# Altium project AEGIS_Junction_Box.PrjPcb
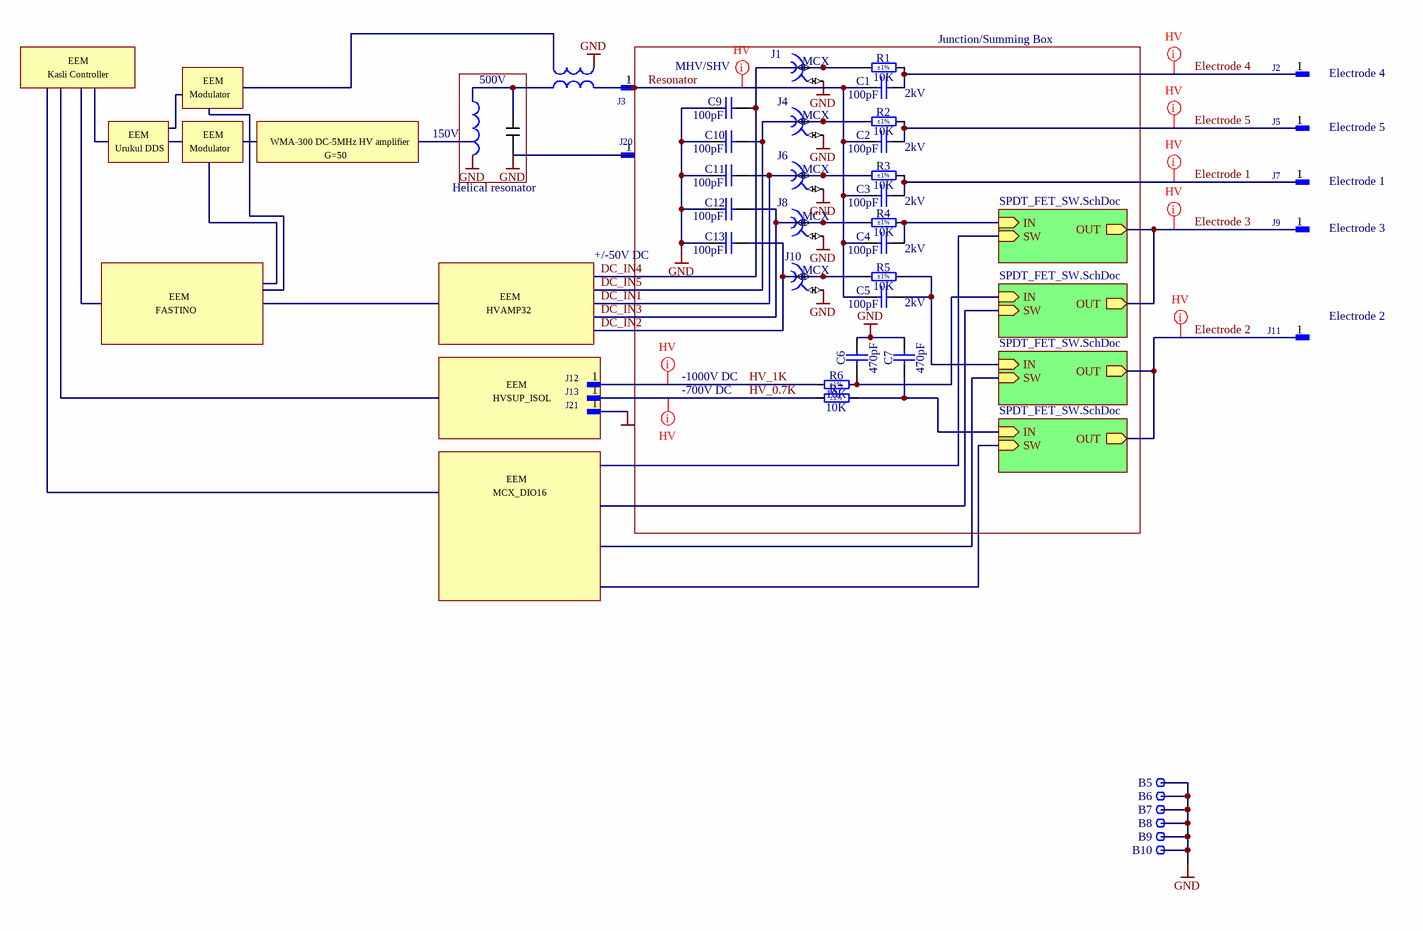
[diagram p0: AEGIS_Junction_Box.SchDoc]
2 sheets, 144 parts. Net scope: hierarchical (ports join the sheet entries above them; power ports are global).
Board file: AEGIS_Junction_Box.PcbDoc
Sheets:
  AEGIS_Junction_Box.SchDoc
    SPDT_HV_SW0 = SPDT_FET_SW.SchDoc
    SPDT_HV_SW1 = SPDT_FET_SW.SchDoc
    SPDT_HV_SW2 = SPDT_FET_SW.SchDoc
    SPDT_HV_SW3 = SPDT_FET_SW.SchDoc

## Sheet AEGIS_Junction_Box.SchDoc: AEGIS
size 420 x 297 mm; Author: G.Kasprowicz; CompanyName: WUT ISE; DrawnBy: G.Kasprowicz; Organization: WUT ISE; Address1: PW ISE; Address2: Nowowiejska 15/19 00-665 Warsaw; Address3: gkasprow@gmail.com; Revision: 2; SheetNumber: -; SheetTotal: -; ModifiedBy: -; CheckedDate: -; Title2: Junction Box; DivGrp: WUT ISE; Designer: G.Kasprowicz; ModifiedDate: -; ProjectName: Sensor Box

### Parts
B5  Plated Hole  [MTG320_550]  (value not drawn)  (no BOM)
B6  Plated Hole  [MTG320_550]  (value not drawn)  (no BOM)
B7  Plated Hole  [MTG320_550]  (value not drawn)  (no BOM)
B8  Plated Hole  [MTG320_550]  (value not drawn)  (no BOM)
B9  Plated Hole  [MTG320_550]  (value not drawn)  (no BOM)
B10  Plated Hole  [MTG320_550]  (value not drawn)  (no BOM)
C1  100pF  Voltage: 2kV  [CAPC3216X180N]
C2  100pF  Voltage: 2kV  [CAPC3216X180N]
C3  100pF  Voltage: 2kV  [CAPC3216X180N]
C4  100pF  Voltage: 2kV  [CAPC3216X180N]
C5  100pF  Voltage: 2kV  [CAPC3216X180N]
C6  470pF  [CAPC4520X150N]
C7  470pF  [CAPC4520X150N]
C9  100pF  [CAPC2012X135N]
C10  100pF  [CAPC2012X135N]
C11  100pF  [CAPC2012X135N]
C12  100pF  [CAPC2012X135N]
C13  100pF  [CAPC2012X135N]
J1  MCX  [AMPHENOL_919-383J-51A]
J2  SMD Pad  [R400X300]  (value not drawn)
J3  SMD Pad  [R400X300]  (value not drawn)
J4  MCX  [AMPHENOL_919-383J-51A]
J5  SMD Pad  [R400X300]  (value not drawn)
J6  MCX  [AMPHENOL_919-383J-51A]
J7  SMD Pad  [R400X300]  (value not drawn)
J8  MCX  [AMPHENOL_919-383J-51A]
J9  SMD Pad  [R400X300]  (value not drawn)
J10  MCX  [AMPHENOL_919-383J-51A]
J11  SMD Pad  [R400X300]  (value not drawn)
J12  SMD Pad  [R400X300]  (value not drawn)
J13  SMD Pad  [R400X300]  (value not drawn)
J20  SMD Pad  [R400X300]  (value not drawn)
J21  SMD Pad  [R400X300]  (value not drawn)
R1  10K  Tolerance: ±1%  [RESC6532X80N]
R2  10K  Tolerance: ±1%  [RESC6532X80N]
R3  10K  Tolerance: ±1%  [RESC6532X80N]
R4  10K  Tolerance: ±1%  [RESC6532X80N]
R5  10K  Tolerance: ±1%  [RESC6532X80N]
R6  10K  Tolerance: ±1%  [RESC6532X80N]
R7  10K  Tolerance: ±1%  [RESC6532X80N]

### Sub-sheets
SPDT_HV_SW0 = SPDT_FET_SW.SchDoc: IN (in), OUT (out), SW (in)
SPDT_HV_SW1 = SPDT_FET_SW.SchDoc: IN (in), OUT (out), SW (in)
SPDT_HV_SW2 = SPDT_FET_SW.SchDoc: IN (in), OUT (out), SW (in)
SPDT_HV_SW3 = SPDT_FET_SW.SchDoc: IN (in), OUT (out), SW (in)

### Nets
GND: B5.1 B6.1 B7.1 B8.1 B9.1 B10.1 C6.2 C7.2 C9.1 C10.1 C11.1 C12.1 C13.1 J1.2 J4.2 J6.2 J8.2 J10.2 J20.1 J21.1
DC_IN1: C11.2 J6.1 R3.1
DC_IN2: C13.2 J10.1 R5.1
DC_IN3: C12.2 J8.1 R4.1
DC_IN4: C9.2 J1.1 R1.1
DC_IN5: C10.2 J4.1 R2.1
Electrode 1: C3.2 J7.1 R3.2
Electrode 2: J11.1 ; sheet SPDT_HV_SW2/OUT, sheet SPDT_HV_SW3/OUT
Electrode 3: J9.1 ; sheet SPDT_HV_SW0/OUT, sheet SPDT_HV_SW1/OUT
Electrode 4: C1.2 J2.1 R1.2
Electrode 5: C2.2 J5.1 R2.2
HV_0.7K: J13.1 R7.1
HV_1K: J12.1 R6.1
Resonator: C1.1 C2.1 C3.1 C4.1 C5.1 J3.1
NetC4_2: C4.2 R4.2 ; sheet SPDT_HV_SW0/IN
NetC5_2: C5.2 R5.2 ; sheet SPDT_HV_SW2/IN
NetC6_1: C6.1 R6.2 ; sheet SPDT_HV_SW1/IN
NetC7_1: C7.1 R7.2 ; sheet SPDT_HV_SW3/IN

### Layout directives
net class HV: Electrode 1, Electrode 2, Electrode 3, Electrode 4, Electrode 5, HV_0.7K, HV_1K, Resonator

### Notes on the sheet
- Kasli Controller
- EEM
- Modulator
- 500V
- MHV/SHV
- Junction/Summing Box
- (near J2) Electrode 4
- Urukul DDS
- WMA-300 DC-5MHz HV amplifier
- G=50
- 150V
- (near J5) Electrode 5
- Helical resonator
- (near J7) Electrode 1
- (near J9) Electrode 3
- +/-50V DC
- FASTINO
- HVAMP32
- -1000V DC
- (near J11) Electrode 2
- HVSUP_ISOL
- -700V DC
- MCX_DIO16
- Labels drawn without touching a wire or pin: GND
- Project/Equipment
- Document
- Designer
- Drawn by
- Check.by
- Copyright WUT ISE 2020.
  This documentation describes Open Hardware and is licensed under the CERN OHL v.1.2. You may redistribute and modify this documentation under the terms of the CERN OHL v.1.2. (http://ohwr.org/CERNOHL). This documentation is distributed WITHOUT ANY EXPRESS OR IMPLIED WARRANTY, INCLUDING OF MERCHANTABILITY, SATISFACTORY QUALITY AND FITNESS FOR A PARTICULAR PURPOSE. Please see the CERN OHL v.1.2 for applicable conditions.
- Contact
- File
- Last Mod.
- Print Date
- Sheet
- Size
- A3
- of
- Rev

### Library data of the parts
B5-B10 = PLATED_HOLE3.2_PAD5.5: Single Terminal Socket; Part Description: Plated Through Hole: Hole Dia.=3.2mm Pad Dia.=5.5mm; Mounted: No; Part Number: PLATED_HOLE3.2_PAD5.5; Component Type: Standard (No BOM); Pin Count: 1; Family: Plated Hole; Socket: No; SMD: No; Sense: No; Status: None; ComponentHeight: 0mm; HelpURL: Undefined; Author: CERN DEM JMW; CreateDate: 01.10.2012; LatestRevisionDate: 01.10.2012; PackageDescription: Plated Through Hole: Hole Dia.=3.2mm Pad Dia.=5.5mm
C1-C5 = CC1206_100PF_2KV_5%_C0G: Non-polarised capacitor; Part Description: High Voltage MLC Chip Capacitor; Manufacturer: GENERIC; Manufacturer1 Part Number: 1206GA101JAT2A; TC: C0G/NP0; Tolerance: ±5%; Part Number: CC1206_100PF_2KV_5%_C0G; Component Kind: Standard; Component Type: Standard; Pin Count: 2; Value: 100pF; Status: None; Manufacturer Part Number: CC1206_100PF_2KV_5%_C0G; Case: 1206; Mounted: Yes; Socket: No; SMD: Yes; Sense: No; Manufacturer1 Example: AVX; Manufacturer1 ComponentHeight: 1.8mm; HelpURL: \\cern.ch\dfs\Applications\Altium\Datasheets\CC1206_C0G_AVX_HV-MLC.pdf; Author: CERN DEM JLC; CreateDate: 17.05.2017; LatestRevisionDate: 17.05.2017
C6 C7 = CC1808_470PF_2KV_20%_X7R_TDK_CGA7K1X7R3D471M130KA: Non-polarised capacitor; Part Description: High Voltage SMD Multilayer Chip Ceramic Capacitor (Automotive Grade); Manufacturer: TDK; Voltage: 2kV; TC: X7R; Tolerance: ±20%; Part Number: CC1808_470PF_2KV_20%_X7R_TDK_CGA7K1X7R3D471M130KA; Component Kind: Standard; Component Type: Standard; Pin Count: 2; Value: 470pF; Status: Not Recommended; Manufacturer Part Number: CGA7K1X7R3D471M130KA; Case: 1808; Mounted: Yes; Socket: No; SMD: Yes; Sense: No; ComponentHeight: 1.5mm; HelpURL: \\cern.ch\dfs\Applications\Altium\Datasheets\CC1808_X7R_TDK_CGA-HV.pdf; Author: CERN DEM JLC; CreateDate: 30.11.2016; LatestRevisionDate: 30.11.2016
C9-C13 = CC0805_100PF_50V_5%_NP0: Non-polarised capacitor; Part Description: SMD Multilayer Chip Ceramic Capacitor; Manufacturer: GENERIC; Manufacturer1 Part Number: 223886115101; Voltage: 50V; TC: C0G/NP0; Tolerance: ±5%; Part Number: CC0805_100PF_50V_5%_NP0; Component Kind: Standard; Component Type: Standard; Pin Count: 2; Value: 100pF; Status: Preferred; Manufacturer Part Number: CC0805_100PF_50V_5%_NP0; Case: 0805; Mounted: Yes; Socket: No; SMD: Yes; Sense: No; Manufacturer1 Example: PHYCOMP; Manufacturer1 ComponentHeight: 1.35mm; HelpURL: \\cern.ch\dfs\Applications\Altium\Datasheets\CC0805_NP0_PHYCOMP.pdf; Author: CERN DEM JLC; CreateDate: 03.12.2007; LatestRevisionDate: 03.12.2007
J1 J4 J6 J8 J10 = AMPHENOL_919-383J-51A: Part Description: 50 Ohm, RF Connector, MCX Right Angle PCB Receptacle Jack; PressFit: No; Part Number: AMPHENOL_919-383J-51A; Component Kind: Standard; Component Type: Standard; Pin Count: 5; Family: MCX; Mounted: Yes; Socket: No; SMD: No; Sense: No; Status: None; Manufacturer: AMPHENOL; Manufacturer Part Number: 919-383J-51A; ComponentHeight: 6mm; HelpURL: \\cern.ch\dfs\Applications\Altium\Datasheets\AMPHENOL_919-383J-51A.pdf; Author: CERN DEM BC; CreateDate: 31.01.2019; LatestRevisionDate: 31.01.2019
J2 J3 J5 J7 J9 J11-J13 J20 J21 = SMD_PAD_4X3MM: Single SMD Pad; Part Description: 4mm x 3mm SMD Pad; Mounted: No; Part Number: SMD_PAD_4X3MM; Component Kind: Standard (No BOM); Component Type: Standard (No BOM); Pin Count: 1; Family: SMD Pad; Socket: No; SMD: No; Sense: No; Status: None; ComponentHeight: 0mm; HelpURL: Undefined; Author: CERN DEM JLC; CreateDate: 15.03.2010; LatestRevisionDate: 15.03.2010; PackageDescription: 4mm x  3mm SMD Pad
R1-R7 = R2512_10k_1%_1W_100PPM: High Voltage (3kV) Chip Resistor; Manufacturer: TT Electronics; Manufacturer Part Number: HVC2512-10KFT18; Power: 1W; TC: ±100ppm/°C; PressFit: No; Part Number: R2512_10k_1%_1W_100PPM; Component Kind: Standard; Component Type: Standard; Pin Count: 2; Value: 10K; Status: None; Part Description: High Voltage (3kV) Chip Resistor; Case: 2512; Mounted: Yes; Sense: No; Socket: No; SMD: Yes; ComponentHeight: 0.8mm; HelpURL: \\cern.ch\dfs\Applications\Altium\Datasheets\R2512_TT ELECTRONICS_HVC.pdf; Author: GK; CreateDate: 26.11.2014; LatestRevisionDate: 26.11.2014

## Sheet SPDT_FET_SW.SchDoc: AEGIS
size 420 x 297 mm; Author: G.Kasprowicz; CompanyName: WUT ISE; DrawnBy: G.Kasprowicz; Organization: WUT ISE; Address1: PW ISE; Address2: Nowowiejska 15/19 00-665 Warsaw; Address3: gkasprow@gmail.com; Revision: 2; SheetNumber: -; SheetTotal: -; ModifiedBy: -; CheckedDate: -; Title2: SPDT HV FET SWITCH; DivGrp: WUT ISE; Designer: G.Kasprowicz; ModifiedDate: -; ProjectName: Sensor Box
Used 4 times, as channels SPDT_HV_SW0, SPDT_HV_SW1, SPDT_HV_SW2, SPDT_HV_SW3. Parts and nets are listed once, with the designators drawn on the sheet.
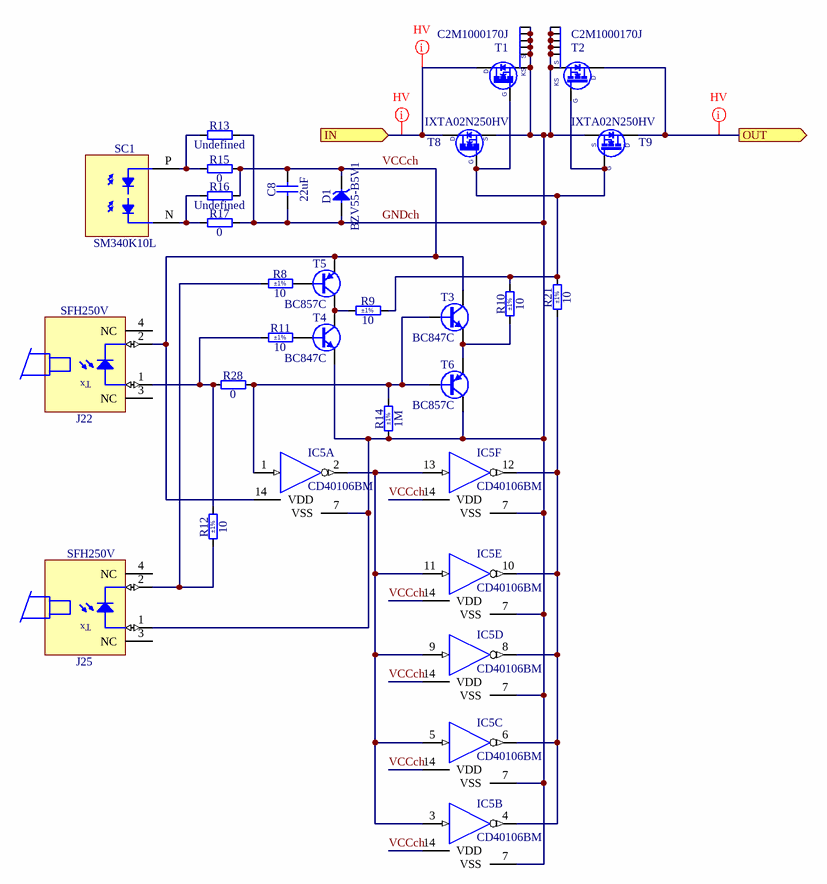
[diagram p1: SPDT_FET_SW.SchDoc]

### Parts
C8  22uF  [CAPC2012X145N]
D1  BZV55-B5V1  [DIOMELF3515N]
IC5  CD40106BM  [SOIC127P600X175-14N]  (parts A,B,C,D,E,F of 6)
J22  SFH250V  [SFH250V]
J25  SFH250V  [SFH250V]
R8  10  Tolerance: ±1%  [RESC1608X55N]
R9  10  Tolerance: ±1%  [RESC1608X55N]
R10  10  Tolerance: ±1%  [RESC1608X55N]
R11  10  Tolerance: ±1%  [RESC1608X55N]
R12  10  Tolerance: ±1%  [RESC1608X55N]
R13  Undefined  [RESC1608X55N]
R14  1M  Tolerance: ±1%  [RESC1005X40N]
R15  0  [RESC1608X55N]
R16  Undefined  [RESC1608X55N]
R17  0  [RESC1608X55N]
R21  10  Tolerance: ±1%  [RESC1608X55N]
R28  0  [RESC1608X55N]
SC1  SM340K10L  [SM340K10L]
T1  C2M1000170J  [WOLFSPEED_TO-263-7]
T2  C2M1000170J  [WOLFSPEED_TO-263-7]
T3  BC847C  [SOT95P240X110-3N]
T4  BC847C  [SOT95P240X110-3N]
T5  BC857C  [SOT95P240X110-3N]
T6  BC857C  [SOT95P240X110-3N]
T8  IXTA02N250HV  [IXYS_TO-263AB]
T9  IXTA02N250HV  [IXYS_TO-263AB]

### Ports
IN (in), OUT (out)

### Nets
GNDch: C8.1 D1.2(A) IC5.7(VSS) J25.1(A) R13.2 R14.1 R17.2 T1.2(S) T1.3(S) T1.4(S) T1.5(S) T1.6(S) T1.7(S) T2.2(S) T2.3(S) T2.4(S) T2.5(S) T2.6(S) T2.7(S) T4.2(E) T6.3(C) T8.2(S) T9.2(S)
IN: T1.8(D) T8.3(D) ; port IN
OUT: T2.8(D) T9.3(D) ; port OUT
VCCch: C8.2 D1.1(C) IC5.14(VDD) J22.2(C) R15.2 R16.2 T3.3(C) T5.2(E)
NetIC5_1: IC5.1(IN) R14.2 R28.2 T3.1(B) T6.1(B)
NetIC5_2: IC5.2(OUT) IC5.3(IN) IC5.5(IN) IC5.9(IN) IC5.11(IN) IC5.13(IN)
NetIC5_4: IC5.4(OUT) IC5.6(OUT) IC5.8(OUT) IC5.10(OUT) IC5.12(OUT) R21.1
NetJ22_1: J22.1(A) R11.1 R12.2 R28.1
NetJ25_2: J25.2(C) R8.1 R12.1
NetR8_2: R8.2 T5.1(B)
NetR9_1: R9.1 T4.3(C) T5.3(C)
NetR9_2: R9.2 R10.2 R21.2 T1.1(G) T2.1(G) T8.1(G) T9.1(G)
NetR10_1: R10.1 T3.2(E) T6.2(E)
NetR11_2: R11.2 T4.1(B)
NetR13_1: R13.1 R15.1 SC1.P
NetR16_1: R16.1 R17.1 SC1.N

Not connected (* = marked no-connect by the designer): J22 3(NC) 4(NC); J25 3(NC) 4(NC)

### Channels
SPDT_HV_SW0: designators end in A; ports IN=NetC4_2 OUT=Electrode 3
SPDT_HV_SW1: designators end in B; ports IN=NetC6_1 OUT=Electrode 3
SPDT_HV_SW2: designators end in C; ports IN=NetC5_2 OUT=Electrode 2
SPDT_HV_SW3: designators end in D; ports IN=NetC7_1 OUT=Electrode 2

### Layout directives
net class HV: Electrode 3, NetC4_2

### Notes on the sheet
- Project/Equipment
- Document
- Designer
- Drawn by
- Check.by
- Copyright WUT ISE 2020.
  This documentation describes Open Hardware and is licensed under the CERN OHL v.1.2. You may redistribute and modify this documentation under the terms of the CERN OHL v.1.2. (http://ohwr.org/CERNOHL). This documentation is distributed WITHOUT ANY EXPRESS OR IMPLIED WARRANTY, INCLUDING OF MERCHANTABILITY, SATISFACTORY QUALITY AND FITNESS FOR A PARTICULAR PURPOSE. Please see the CERN OHL v.1.2 for applicable conditions.
- Contact
- File
- Last Mod.
- Print Date
- Sheet
- Size
- A3
- of
- Rev
- (in symbol C2M1000170J) KS
- (in symbol SFH250V) Tx

### Library data of the parts
C8 = CC0805_22UF_25V_20%_X5R: Non-polarised capacitor; Part Description: Chip Multilayer Ceramic Capacitor for General Purpose; Manufacturer: GENERIC; Manufacturer1 Part Number: GRM21BR61E226ME44; Voltage: 25V; TC: X5R; Tolerance: ±20%; Part Number: CC0805_22UF_25V_20%_X5R; Component Kind: Standard; Component Type: Standard; Pin Count: 2; Value: 22uF; Status: Preferred; Manufacturer Part Number: CC0805_22UF_25V_20%_X5R; Case: 0805; Mounted: Yes; Socket: No; SMD: Yes; Sense: No; ComponentHeight: 1.45mm; Manufacturer1 Example: MURATA; Manufacturer1 ComponentHeight: 1.45mm; HelpURL: \\cern.ch\dfs\Applications\Altium\Datasheets\CC0805_MURATA_GRM21BR61E226ME44.pdf; Author: CERN DEM WB; CreateDate: 08.10.2021; LatestRevisionDate: 08.10.2021
D1 = BZV55-B5V1: Zener Diode; Part Description: Voltage Regulator Diode; Manufacturer: NEXPERIA; Voltage: 5V1; Power: 500mW; PressFit: No; Bonding: No; Part Number: BZV55-B5V1; Component Kind: Standard; Component Type: Standard; Device: BZV55-B5V1; PackageDescription: SOD80C, MELF Diode, 2-Leads, Body 3.5x1.5mm, IPC Medium Density; Manufacturer Part Number: BZV55-B5V1; Pin Count: 2; Case: SOD-80C; Mounted: Yes; Socket: No; SMD: Yes; Sense: No; ComponentHeight: 1.6mm; HelpURL: \\cern.ch\dfs\Applications\Altium\Datasheets\BZV55.pdf; Author: CERN DEM JLC; CreateDate: 06.05.2008; LatestRevisionDate: 22.01.2018
IC5 = CD40106BM: Hex Inverting Schmitt-Trigger; Part Description: CMOS Hex Schmitt Triggers; Manufacturer: TEXAS INSTRUMENTS; PressFit: No; Bonding: No; Part Number: CD40106BM; Component Kind: Standard; Component Type: Standard; Device: CD40106BM; PackageDescription: SOIC 14, Pitch 1.27mm - Body 4x8.75mm, IPC Medium Density; Manufacturer Part Number: CD40106BM; Pin Count: 14; Case: SOIC14; Mounted: Yes; Socket: No; SMD: Yes; Sense: No; ComponentHeight: 1.75mm; Author: CERN DEM JLC; HelpURL: \\cern.ch\dfs\Applications\Altium\Datasheets\CD40106BM.pdf; CreateDate: 17.01.2012; LatestRevisionDate: 17.01.2012
J22 J25 = SFH250V: Plastic Connector Housing For Plastic Fiber Optic Photodiode Detector; Part Description: 100MBd Analog Receiver Diode with Direct Fiber Connector; Manufacturer: AVAGO TECHNOLOGIES; Manufacturer Part Number: SFH250V or SP000063852; PressFit: No; Part Number: SFH250V; Component Kind: Standard; Component Type: Standard; Device: SFH250V; Pin Count: 2; Family: Optical Fiber; Mounted: Yes; Socket: No; SMD: No; Sense: No; Status: None; ComponentHeight: 9mm; HelpURL: \\cern.ch\dfs\Applications\Altium\Datasheets\SFH250V.pdf; Author: CERN DEM JLC; CreateDate: 07.10.2010; LatestRevisionDate: 21.08.2014
R8-R12 R21 = R0603_10R_1%_0.1W_200PPM: Resistor - 1%; Part Description: General Purpose Thick Film Chip Resistor; Manufacturer: GENERIC; Manufacturer1 Part Number: NRC06F10R0TRF; Power: 0.1W; TC: ±200ppm/°C; PressFit: No; Part Number: R0603_10R_1%_0.1W_200PPM; Component Kind: Standard; Component Type: Standard; Pin Count: 2; Value: 10; Status: Preferred; Manufacturer Part Number: R0603_10R_1%_0.1W_200PPM; Case: 0603; Mounted: Yes; Sense: No; Socket: No; SMD: Yes; Manufacturer1 Example: NIC COMPONENT; Manufacturer1 ComponentHeight: 0.55mm; HelpURL: \\cern.ch\dfs\Applications\Altium\Datasheets\R0603_NIC_NRC.pdf; Author: CERN DEM JLC; CreateDate: 03.12.2007; LatestRevisionDate: 24.06.2009
R13 R16 = R0603_NO-VALUE: Resistor; Part Description: Reserved Footprint For a 0603 (1608) Chip Resistor; PressFit: No; Mounted: No; Part Number: R0603_NO-VALUE; Component Kind: Standard; Component Type: Standard; Pin Count: 2; Value: Undefined; Status: None; Manufacturer: Undefined; Manufacturer Part Number: R0603_NO-VALUE; Case: 0603; Sense: No; Socket: No; SMD: Yes; Manufacturer1 Example: Undefined; Manufacturer1 Part Number: Undefined; Manufacturer1 ComponentHeight: Undefined; HelpURL: Undefined; Author: CERN DEM JLC; CreateDate: 03.12.2007; LatestRevisionDate: 13.03.2008
R14 = R0402_1M_1%_0.0625W_100PPM: Resistor - 1%; Part Description: General Purpose Thick Film Chip Resistor; Manufacturer: GENERIC; Manufacturer1 Part Number: 232270671005L; TC: ±100ppm/°C; PressFit: No; Part Number: R0402_1M_1%_0.0625W_100PPM; Component Kind: Standard; Component Type: Standard; Pin Count: 2; Value: 1M; Status: Not Recommended; Power: 0.0625W; Manufacturer Part Number: R0402_1M_1%_0.0625W_100PPM; Case: 0402; Mounted: Yes; Sense: No; Socket: No; SMD: Yes; Manufacturer1 Example: YAGEO PHYCOMP; Manufacturer1 ComponentHeight: 0.4mm; HelpURL: \\cern.ch\dfs\Applications\Altium\Datasheets\R0402_Phycomp_RC0402.pdf; Author: CERN DEM JLC; CreateDate: 03.12.2007; LatestRevisionDate: 17.10.2012
R15 R17 R28 = R0603_0R_JUMPER: Resistor; Part Description: 1A (0.05R Max DC Resistance) Zero Ohm Jumper; Manufacturer: GENERIC; Manufacturer1 Part Number: NRC06Z0; PressFit: No; Part Number: R0603_0R_JUMPER; Component Kind: Standard; Component Type: Standard; Pin Count: 2; Value: 0; Status: Preferred; Manufacturer Part Number: R0603_0R_JUMPER; Case: 0603; Mounted: Yes; Sense: No; Socket: No; SMD: Yes; Manufacturer1 Example: NIC COMPONENT; Manufacturer1 ComponentHeight: 0.55mm; HelpURL: \\cern.ch\dfs\Applications\Altium\Datasheets\R0603_NIC_NRC.pdf; Author: CERN DEM JLC; CreateDate: 03.12.2007; LatestRevisionDate: 13.03.2008
SC1 = SOLAR_SM340K10L: MONOCRYSTAL SOLAR CELL 73.5MW 6.91V; Manufacturer: ANYSOLAR; PressFit: No; Bonding: No; Part Number: SM340K10L; Component Kind: Standard; Component Type: Standard; Device: SM340K10L; PackageDescription: ANYSOLAR 34,0mm x 16,0mm x 2,0mm; Part Description: MONOCRYSTAL SOLAR CELL 73.5MW 6.91V; Manufacturer Part Number: SM340K10L; Pin Count: 6; Case: 33x16; Mounted: Yes; Socket: No; SMD: Yes; Sense: No; ComponentHeight: 2; HelpURL: \\cern.ch\dfs\Applications\Altium\Datasheets\TLP3910.pdf; Author: GK; CreateDate: 07.06.2022; LatestRevisionDate: 07.06.2022
T1 T2 = C2M1000170J: N-CHANNEL MOSFET WITH DIODE; Part Description: 1700V, 5.3A, Silicon Carbide Power MOSFET C2M; Manufacturer: WOLFSPEED; PressFit: No; Bonding: No; Part Number: C2M1000170J; Component Kind: Standard; Component Type: Standard; Device: C2M1000170J; PackageDescription: TO-263-7, 1.27mm Pitch; 7 Pin,10.18mm W X 11.60mm L X 4.57mm H body; Manufacturer Part Number: C2M1000170J; Pin Count: 8; Case: TO-263-7; Mounted: Yes; Socket: No; SMD: Yes; Sense: No; ComponentHeight: 4.570; HelpURL: \\cern.ch\dfs\Applications\Altium\Datasheets\C2M1000170J.pdf; Author: CERN DEM HF; CreateDate: 07.06.2022; LatestRevisionDate: 07.06.2022
T3 T4 = BC847C: NPN Transistor; Part Description: 45V 100mA NPN Silicon AF Transistor; Manufacturer: INFINEON; PressFit: No; Bonding: No; Part Number: BC847C; Component Kind: Standard; Component Type: Standard; Device: BC847C; PackageDescription: SOT23, 0.95mm Pitch; 3 Pin, 1.40mm W X 3.00mm L X 1.10mm H body, IPC Medium Density; Manufacturer Part Number: BC847C; Pin Count: 3; Case: SOT23-3; Mounted: Yes; Socket: No; SMD: Yes; Sense: No; ComponentHeight: 1.1mm; HelpURL: \\cern.ch\dfs\Applications\Altium\Datasheets\BC847C.pdf; Author: CERN DEM JLC; CreateDate: 23.09.2014; LatestRevisionDate: 23.09.2014
T5 T6 = BC857C: PNP Transistor; Part Description: -45V -100mA PNP  Silicon AF Transistor; Manufacturer: INFINEON; PressFit: No; Bonding: No; Part Number: BC857C; Component Kind: Standard; Component Type: Standard; Device: BC857C; PackageDescription: SOT23, 0.95mm Pitch; 3 Pin, 1.40mm W X 3.00mm L X 1.10mm H body, IPC Medium Density; Manufacturer Part Number: BC857C; Pin Count: 3; Case: SOT23-3; Mounted: Yes; Socket: No; SMD: Yes; Sense: No; ComponentHeight: 1.1mm; HelpURL: \\cern.ch\dfs\Applications\Altium\Datasheets\BC857C.pdf; Author: CERN DEM JLC; CreateDate: 23.09.2014; LatestRevisionDate: 23.09.2014
T8 T9 = IXTA02N250HV: N-CHANNEL MOSFET WITH DIODE; Part Description: 2600V 0.2A N-Channel Power MOSFET; Manufacturer: IXYS; Manufacturer Part Number: TO-263AB; PressFit: No; Bonding: No; Part Number: IXTA02N250HV; Component Kind: Standard; Component Type: Standard; Device: IXTA02N250HV; PackageDescription: D2PAK TO-263AB TO, 5.08mm Pitch; 2 Pin, 15.30mm L X 10.00mm W X 4.7mm H body; Pin Count: 3; Case: TO-263AB; Mounted: Yes; Socket: No; SMD: Yes; Sense: No; ComponentHeight: 4.70mm; HelpURL: \\cern.ch\dfs\Applications\Altium\Datasheets\IXTA02N250HV.pdf; Author: CERN DEM HF; CreateDate: 08.06.2022; LatestRevisionDate: 08.06.2022

## Nets that join several sheets
Electrode 2: AEGIS_Junction_Box (J11.1), SPDT_HV_SW2 (T2C.8 T9C.3), SPDT_HV_SW3 (T2D.8 T9D.3)
Electrode 3: AEGIS_Junction_Box (J9.1), SPDT_HV_SW0 (T2A.8 T9A.3), SPDT_HV_SW1 (T2B.8 T9B.3)
NetC4_2: AEGIS_Junction_Box (C4.2 R4.2), SPDT_HV_SW0 (T1A.8 T8A.3)
NetC5_2: AEGIS_Junction_Box (C5.2 R5.2), SPDT_HV_SW2 (T1C.8 T8C.3)
NetC6_1: AEGIS_Junction_Box (C6.1 R6.2), SPDT_HV_SW1 (T1B.8 T8B.3)
NetC7_1: AEGIS_Junction_Box (C7.1 R7.2), SPDT_HV_SW3 (T1D.8 T8D.3)

## Assembly variants
std: not fitted R8_1 R8_1 R8_1 R8_2 R8_2 R8_2 R8_3 R8_3 R8_3 R8_4 R8_4 R8_4 R21_1 R21_2 R21_3 R21_4 T3_1 T3_2 T3_3 T3_4 T5_1 T5_2 T5_3 T5_4 T8_1 T8_2 T8_3 T8_4 T9_1 T9_2 T9_3 T9_4